# EAGLE design led_daughter_new_led (EAGLE 7.3.0)
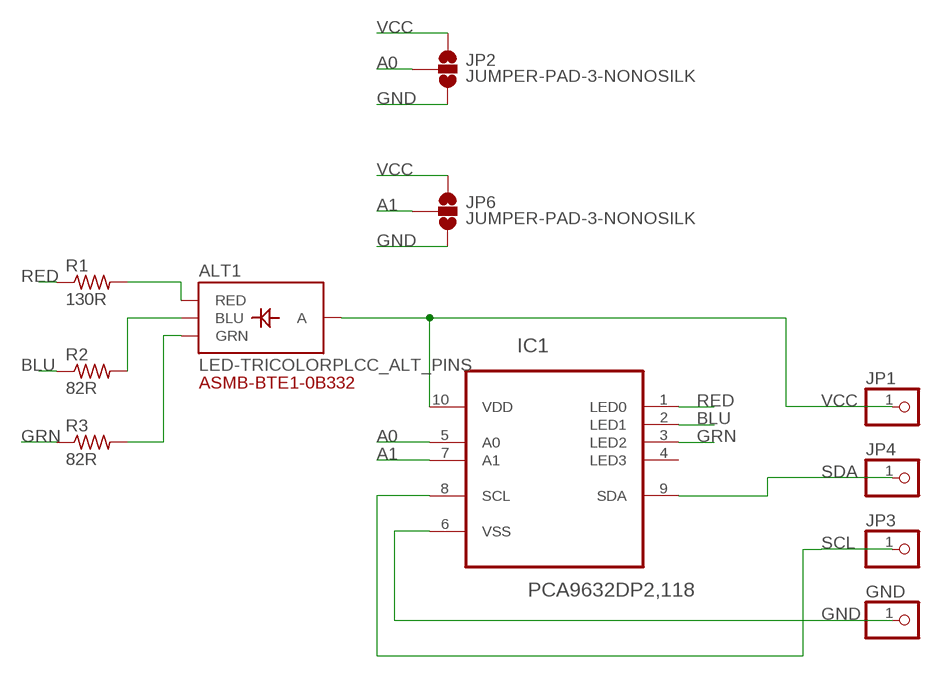
[diagram p0: schematic, sheet 1]

## Parts
ALT1  LED-TRICOLORPLCC_ALT_PINS  [LED-TRICOLOR-PLCC]
GND  PINHD-1X1CB  [1X01-CLEANBIG]
IC1  PCA9632DP2,118  [SOP50P490X110-10N]
JP1  PINHD-1X1CB  [1X01-CLEANBIG]
JP2  JUMPER-PAD-3-NONOSILK  [PAD-JUMPER-3-NO_NO_SILK]
JP3  PINHD-1X1CB  [1X01-CLEANBIG]
JP4  PINHD-1X1CB  [1X01-CLEANBIG]
JP6  JUMPER-PAD-3-NONOSILK  [PAD-JUMPER-3-NO_NO_SILK]
R1  130R  R-US_R0603  [R0603]
R2  82R  R-US_R0603  [R0603]
R3  82R  R-US_R0603  [R0603]

## Nets
A0: IC1.5(A0) JP2.2
A1: IC1.7(A1) JP6.2
BLU: IC1.2(LED1) R2.1
GND: GND.1 IC1.6(VSS) JP2.3 JP6.3
GRN: IC1.3(LED2) R3.1
N$1: ALT1.PAD3(RED) R1.2
N$2: ALT1.PAD1(BLU) R2.2
N$3: ALT1.PAD4(GRN) R3.2
RED: IC1.1(LED0) R1.1
SCL: IC1.8(SCL) JP3.1
SDA: IC1.9(SDA) JP4.1
VCC: ALT1.PAD2(A) IC1.10(VDD) JP1.1 JP2.1 JP6.1
Unconnected: IC1.4(LED3)

## Notes on the sheet
- ASMB-BTE1-0B332

## Library data of the parts
ALT1 = SparkFun-LED:LED-TRICOLOR: Tri-Color LED SMD Proven layout and schematic for triple color LED in SMD package - common anode. Spark Fun Electronics SKU : COM-07844
GND JP1 JP3 JP4 = adafruit:PINHD-1X1: Pin header 1x1 for 0.1" spacing With round pins
IC1 = NXP_By_element14_Batch_1:PCA9632DP2,118: 4-bit Fm+ I2C-bus low power LED driver; MPN: PCA9632DP2,118; OC_FARNELL: 1867849; OC_NEWARK: 70R6723; PACKAGE: TSSOP-10; SUPPLIER: NXP
JP2 JP6 = SparkFun-Passives:JUMPER-PAD-3-NO
R1-R3 = adafruit:R-US_: RESISTOR, American symbol

## Board
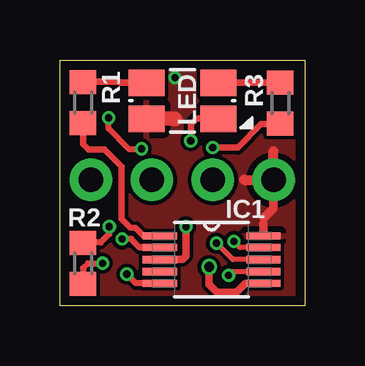
[diagram p1: board, top side]
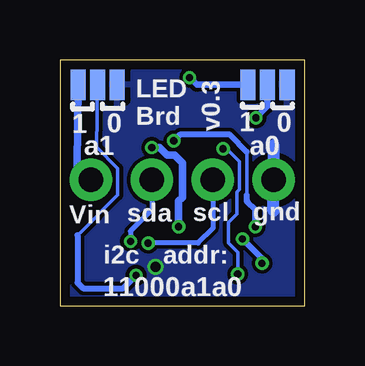
[diagram p2: board, bottom side, seen from below]

Size 10.21 x 10.26 mm. Coordinates in mm from the lower left corner, seen from the top.
Outline: 0,10.26 10.21,10.26 10.21,0 0,0 0,10.26
Copper layers (1*16): Top 0.035559375mm / dielectric 1.6mm / Bottom 0.035559375mm
Design rules "oshpark-2layer *": minimum track width 6mil, minimum drill 10mil, track to track 6mil, track to pad 6mil, pad to pad 6mil, via to via 6mil, smd to smd 6mil, copper to edge 15mil, drill to drill 6mil, minimum pad ring 5mil, minimum via ring 5mil, stop-mask expansion 2mil, vias tented up to drill 16mil, thermal gap 10mil
tRestrict: area 2.6,7.6 to 2.8,8

### Footprints (pad centres in the part's own frame; a part is rotated, then mirrored left to right if it is on the bottom)
LED-TRICOLOR-PLCC = smd 1.5 x 1.1: PAD1 1.5,-0.75; PAD2 -1.5,-0.75; PAD3 -1.5,0.75; PAD4 1.5,0.75
1X01-CLEANBIG = drill 1.016 pad 1.778: 1 0,0
SOP50P490X110-10N = smd 1.422 x 0.305: 1 -2.159,0.991; 2 -2.159,0.508; 3 -2.159,0; 4 -2.159,-0.508; 5 -2.159,-0.991; 6 2.159,-0.991; 7 2.159,-0.508; 8 2.159,0; 9 2.159,0.508; 10 2.159,0.991
PAD-JUMPER-3-NO_NO_SILK = smd 0.635 x 1.27: 1 -0.813,0; 2 0,0; 3 0.813,0
R0603 = smd 1 x 1.1: 1 -0.85,0; 2 0.85,0

### Placement (x,y rotation side)
ALT1  5.11,8.56 0 top
GND  1.3,5.26 0 top
IC1  6.32,1.93 0 top
JP1  8.92,5.26 0 top
JP2  1.55,9.22 0 bottom
JP3  3.84,5.26 0 top
JP4  6.38,5.26 0 top
JP6  8.64,9.22 0 bottom
R1  0.97,8.48 90 top
R2  0.97,1.78 90 top
R3  9.19,8.46 90 top

### Tracks (layer width: path | path; a pad name or v marks a point on that pad's centre or on a via)
A0  (via drill 0.3)
  Top 0.254: v3.4,6.55 2.87,6.55 2.03,7.39 v2.03,7.85 | IC1.5 3.18,0.94 v2.79,1.32
  Bottom 0.152: v3.4,6.55 3.25,6.55 2.72,6.02 2.72,4.85 2.82,4.75 2.82,3.84 3.18,3.48 3.18,2.62 2.79,2.24 v2.79,1.32
  Bottom 0.279: JP2.2 1.55,8.33 v2.03,7.85
A1  (via drill 0.3)
  Top 0.203: IC1.7 7.19,1.42 v7.04,1.27
  Bottom 0.152: JP6.2 8.69,6.63 7.8,5.74 7.8,4.62 9.47,2.95
  Bottom 0.254: 9.47,2.95 9.47,0.97 9.25,0.74 7.57,0.74 v7.04,1.27
BLU  (via drill 0.3)
  Top 0.254: R2.1 0.97,1.57 1.17,1.78 v1.78,1.78 | IC1.2 3.33,2.44 2.97,2.79 v2.59,2.79
  Bottom 0.254: v1.78,1.78 1.78,1.98 v2.59,2.79
GND  (via drill 0.4)
  Top 0.305: IC1.6 7.75,0.94 7.37,0.56 6.55,0.56 6.22,0.89 v6.22,1.63
  Bottom 0.356: 1.3,6.5 1.3,5.79 1.3,4.78 | 1.3,3.96 1.3,3.94
  Bottom 0.508: 1.3,6.71 1.3,5.79 | 1.3,3.96 1.3,4.78
  pour Bottom: -0.05,10.26 -0.05,0 10.26,0 10.26,10.26
GRN  (via drill 0.3)
  Top 0.279: R3.1 9.17,7.58 8.4,7.58 7.42,6.6 v6.38,6.6
  Top 0.305: IC1.3 5.11,1.93 5.26,2.08 v5.26,3.3
  Bottom 0.305: v5.26,3.3 5.26,4.37 5.11,4.52 5.11,5.97 5.44,6.3 5.74,6.3 6.05,6.6 v6.38,6.6
N$1
  Top 0.203: 0.99,9.36 R1.2
  Top 0.279: 0.99,9.36 2.48,9.36 2.51,9.32 3.59,9.32 ALT1.PAD3
N$2  (via drill 0.3)
  Top 0.254: v2.06,3.3 2.06,3 1.7,2.64 0.98,2.64 R2.2
  Top 0.279: v5.46,6.88 5.46,7.59 5.69,7.82 6.59,7.82 ALT1.PAD1
  Bottom 0.152: 2.39,4.34 2.41,4.37 | 2.41,4.62 2.41,6.43
  Bottom 0.254: v2.06,3.3 2.06,4.01 2.39,4.34 | v5.46,6.88 5.21,7.14 3.12,7.14 2.41,6.43 | 2.41,4.37 2.41,4.62
N$3
  Top 0.203: 9,9.3 R3.2
  Top 0.279: ALT1.PAD4 R3.2
RED
  Top 0.203: 0.98,7.62 R1.1
  Top 0.254: IC1.1 3.48,2.92 3.15,3.25 2.95,3.25 2.57,3.63
  Top 0.279: 2.57,3.63 2.57,5.82 1.85,6.53 1.19,6.53 0.97,6.76 R1.1
SCL  (via drill 0.3)
  Top 0.203: IC1.8 7.21,1.93 v6.53,2.62
  Bottom 0.203: JP3.1 3.84,3.23 4.45,2.62 v6.53,2.62
SDA  (via drill 0.3)
  Top 0.203: IC1.9 7.52,2.44 v7.26,2.69
  Bottom 0.203: JP4.1 6.38,4.01 7.26,3.12 v7.26,2.69
VCC  (via drill 0.3)
  Top 0.356: JP1.1 8.92,4.06 8.51,3.66 | 8.48,2.95 8.48,3.43
  Top 0.406: 7.7,5.26 8.86,5.26 | 8.92,5.28 8.92,6.45
  Top 0.61: ALT1.PAD2 4.79,7.81 4.8,7.8
  Bottom 0.279: JP2.1 4.5,9.22 v4.8,9.52
  Bottom 0.305: JP6.1 9.5,5.84 JP1.1
  pour Top: 0.03,10.26 0.03,0 10.19,0 10.19,10.26

### Text on the board
tPlace: LED
bPlace: 0 | 1 | v0.3 | LED / Brd | 0 | 1 | a0 | a1 | gnd | scl | sda | Vin | addr: | i2c | 11000a1a0